# Altium schematic sheet XL6009.SchDoc
size B
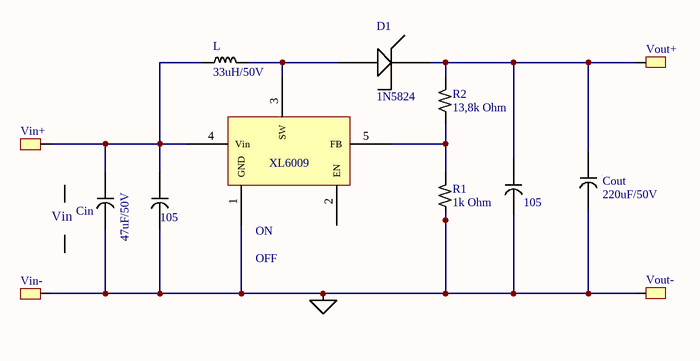
[diagram p0: XL6009.SchDoc]

## Parts
1  105  [PCBComponent_1]
105  105  [PCBComponent_1]  (value not drawn)
*  Component_1  (value not drawn)
*1  Component_2  (value not drawn)
*2  Component_2  (value not drawn)
Cin  47uF/50V  [PCBComponent_1]
Cout  220uF/50V  [PCBComponent_1]
D1  1N5824  [1N5824]
L  33uH/50V  [PCBComponent_1]
R1  1k Ohm  [PCBComponent_1]
R2  13,8k Ohm  [PCBComponent_1]
Vin+  p1  [P1]  (value not drawn)
Vin-  p1  [P1]  (value not drawn)
Vout+  p1  [P1]  (value not drawn)
Vout-  p1  [P1]  (value not drawn)
XL6009  XL6009  [XL6009]  (value not drawn)

## Nets
GND: 1.2 105.2 Cin.2 Cout.2 R1.1 Vin-.21 Vout-.21 XL6009.1(GND)
Net1_1: 1.1 Cout.1 D1.1 R2.2 Vout+.21
Net105_1: 105.1 Cin.1 L.1 Vin+.21 XL6009.4(Vin)
NetD1_2: D1.2 L.2 XL6009.3(SW)
NetR1_2: R1.2 R2.1 XL6009.5(FB)

Not connected (* = marked no-connect by the designer): XL6009 2(EN)

## Notes on the sheet
- (near *1) Vin
- (near *) ON
- (near *) OFF

## Library data of the parts
Cin Cout = capacitor
D1 = diode
L = Electrolytic Cap
R1 R2 = resistor